# Altium schematic sheet SCH_GPS.SchDoc
size A; SheetNumber: 1; SheetTotal: 1
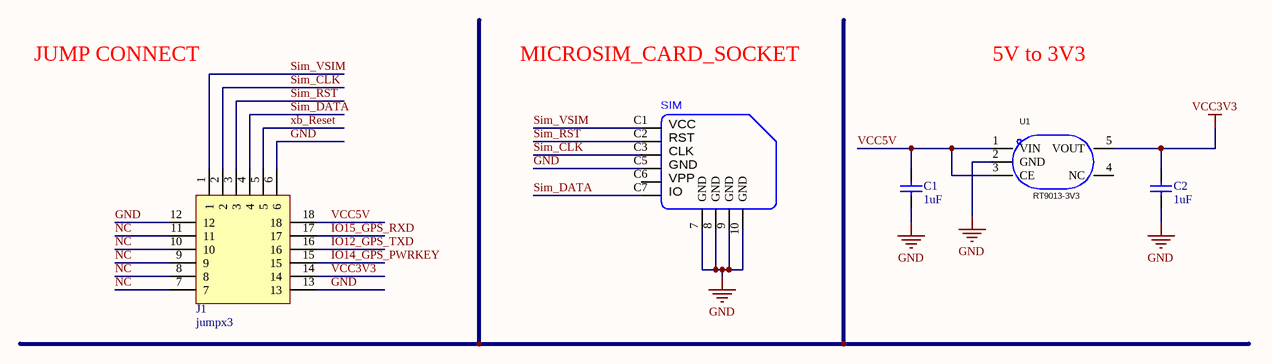
[diagram p0: SCH_GPS.SchDoc]

## Parts
C1  1uF  [CAP_0805]
C2  1uF  [CAP_0805]
J1  jumpx3
SIM  MICROSIM_CARD_SOCKET  [SIM-SMD_SIM_CARD_MINI2]  (value not drawn)
U1  RT9013-3V3  [SOT-23-5]

## Nets
GND: C1.1 C2.1 J1.6 J1.12 J1.13 SIM.7(GND) SIM.8(GND) SIM.9(GND) SIM.10(GND) SIM.C5 U1.2(GND)
VCC3V3: C2.2 J1.14 U1.5(VOUT)
IO12_GPS_TXD: J1.16
IO14_GPS_PWRKEY: J1.15
IO15_GPS_RXD: J1.17
NC: J1.7 J1.8 J1.9 J1.10 J1.11
Sim_CLK: J1.2 SIM.C3
Sim_DATA: J1.4 SIM.C7
Sim_RST: J1.3 SIM.C2
Sim_VSIM: J1.1 SIM.C1
VCC5V: C1.2 J1.18 U1.1(VIN) U1.3(CE)
xb_Reset: J1.5

Not connected (* = marked no-connect by the designer): SIM C6; U1 4(NC)

## Notes on the sheet
- JUMP CONNECT
- MICROSIM_CARD_SOCKET
- 5V to 3V3
- (in symbol MICROSIM_CARD_SOCKET) VCC; RST; CLK; VPP; IO

## Library data of the parts
C1 C2 = CAP104-100nF-50V: Capacitor; 104: 100nF
U1 = RT9013-3V3: Manufacturer: TECH PUBLIC(台舟); Manufacturer Part: RT9013-28GB; Symbol: RT9013-28GB_C22435117; Add into BOM: yes; Output Type: Fixed; Maximum Input Voltage: 7V; Output Voltage: 2.8V; Output Current: 500mA; Power Supply Rejection Ratio (PSRR): 75dB@(1kHz); Output Polarity: Positive electrode; Number of Outputs: 1; Device: RT9013-28GB_C22435117; LCSC Part Name: RT9013-28GB; Supplier Part: C22435117; Supplier Footprint: SOT-23-5; JLCPCB Part Class: Extended Part; Datasheet: https://atta.szlcsc.com/upload/public/pdf/source/20240521/DB02A3BD143559C4B04B4636EC1C1987.pdf; Supplier: LCSC; Convert to PCB: yes; Operating Temperature: -40℃~+85℃@(Ta)